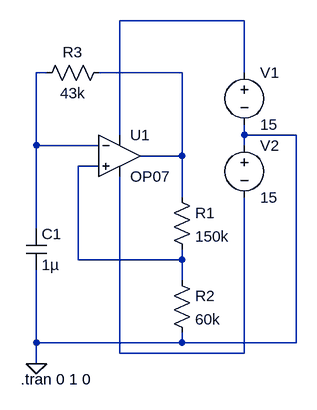
[diagram p0: schematic Draft2.asc]
Draft2.asc, the LTspice schematic file:
Version 4
SHEET 1 880 680
WIRE 448 -48 256 -48
WIRE 144 32 128 32
WIRE 352 32 224 32
WIRE 448 32 448 -48
WIRE 256 128 256 -48
WIRE 448 128 448 112
WIRE 528 128 448 128
WIRE 128 144 128 32
WIRE 224 144 128 144
WIRE 448 144 448 128
WIRE 352 160 352 32
WIRE 352 160 288 160
WIRE 224 176 192 176
WIRE 352 224 352 160
WIRE 128 272 128 144
WIRE 192 320 192 176
WIRE 352 320 352 304
WIRE 352 320 192 320
WIRE 352 352 352 320
WIRE 128 448 128 336
WIRE 352 448 352 432
WIRE 352 448 128 448
WIRE 528 448 528 128
WIRE 528 448 352 448
WIRE 256 464 256 192
WIRE 448 464 448 224
WIRE 448 464 256 464
WIRE 128 480 128 448
FLAG 128 480 0
SYMBOL OpAmps\\OP07 256 96 R0
SYMATTR InstName U1
SYMBOL voltage 448 16 R0
WINDOW 123 0 0 Left 0
WINDOW 39 0 0 Left 0
SYMATTR InstName V1
SYMATTR Value 15
SYMBOL voltage 448 128 R0
WINDOW 123 0 0 Left 0
WINDOW 39 0 0 Left 0
SYMATTR InstName V2
SYMATTR Value 15
SYMBOL res 336 208 R0
SYMATTR InstName R1
SYMATTR Value 150k
SYMBOL res 336 336 R0
SYMATTR InstName R2
SYMATTR Value 60k
SYMBOL cap 112 272 R0
SYMATTR InstName C1
SYMATTR Value 1µ
SYMBOL res 240 16 R90
WINDOW 0 0 56 VBottom 2
WINDOW 3 32 56 VTop 2
SYMATTR InstName R3
SYMATTR Value 43k
TEXT 104 504 Left 2 !.tran 0 1 0

The netlist it stands for:
* Draft2.asc
XU1 N004 N002 N001 N005 N003 LT1001  ; OP07, pins In+ In- V+ V- OUT
V1 N001 0 15
V2 0 N005 15
R1 N003 N004 150k
R2 N004 0 60k
C1 N002 0 1µ
R3 N003 N002 43k
.tran 0 1 0
.lib LTC.lib
.backanno
.end